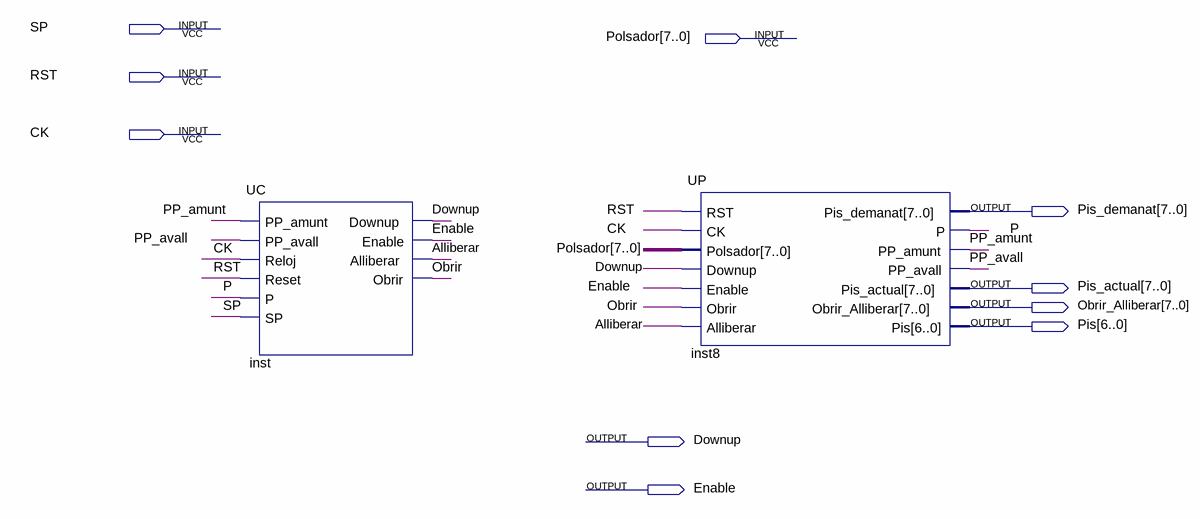
[diagram p0: schematic sheet]
// Quartus schematic ControlAscensor.bdf as structural Verilog: 2 symbols, 10 pins
module ControlAscensor (
  input  SP,
  input  [7:0] Polsador,
  input  RST,
  input  CK,
  output [7:0] Pis_demanat,
  output [7:0] Pis_actual,
  output [7:0] Obrir_Alliberar,
  output [6:0] Pis,
  output Downup,
  output Enable
);

  wire Alliberar, Obrir, P, PP_amunt, PP_avall;

  UC inst (
    .PP_amunt(PP_amunt), .PP_avall(PP_avall), .Reloj(CK), .Reset(RST), .P(P), .SP(SP), .Downup(Downup),
    .Enable(Enable), .Alliberar(Alliberar), .Obrir(Obrir));
  UP inst8 (
    .RST(RST), .CK(CK), .Polsador(Polsador), .Downup(Downup), .Enable(Enable), .Obrir(Obrir),
    .Alliberar(Alliberar), .Pis_demanat(Pis_demanat), .P(P), .PP_amunt(PP_amunt), .PP_avall(PP_avall),
    .Pis_actual(Pis_actual), .Obrir_Alliberar(Obrir_Alliberar), .Pis(Pis));
endmodule
